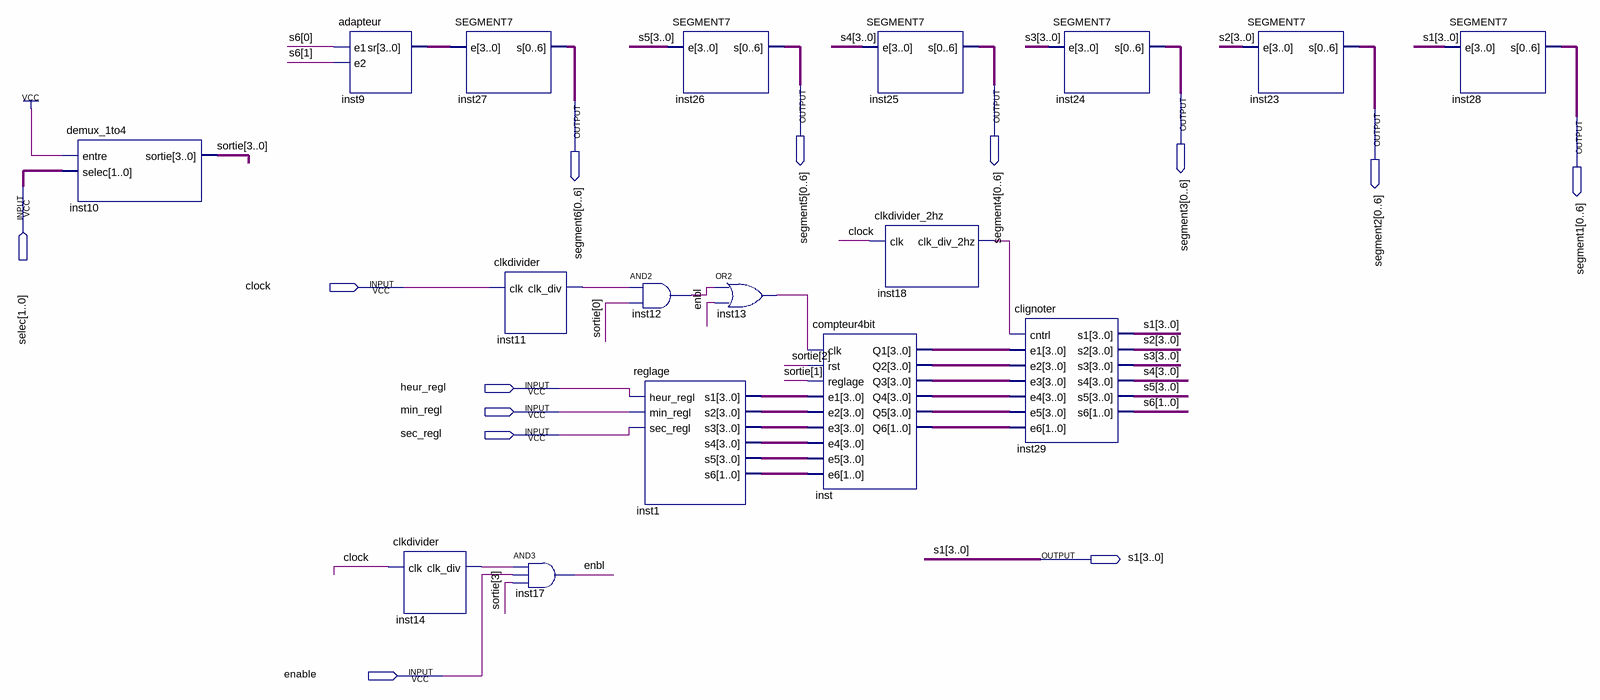
[diagram p0: schematic sheet]
// Quartus schematic disigne_principl.bdf as structural Verilog: 17 symbols, 13 pins
module disigne_principl (
  input  [1:0] selec,
  input  clock,
  input  heur_regl,
  input  min_regl,
  input  sec_regl,
  input  enable,
  output [0:6] segment5,
  output [0:6] segment4,
  output [0:6] segment3,
  output [0:6] segment6,
  output [0:6] segment2,
  output [0:6] segment1,
  output [3:0] s1
);

  wire enbl, inst11_clk_div, inst12_out, inst13_out, inst14_clk_div, inst18_clk_div_2hz;
  wire [1:0] inst1_s6, inst_q6, s6;
  wire [3:0] inst1_s1, inst1_s2, inst1_s3, inst1_s4, inst1_s5, inst9_sr, inst_q1, inst_q2, inst_q3, inst_q4,
       inst_q5, s2, s3, s4, s5, sortie;

  demux_1to4 inst10 (.entre(1'b1), .selec(selec), .sortie(sortie));
  adapteur inst9 (.e1(s6[0]), .e2(s6[1]), .sr(inst9_sr));
  clkdivider inst14 (.clk(clock), .clk_div(inst14_clk_div));
  SEGMENT7 inst27 (.e(inst9_sr), .s(segment6));
  clkdivider inst11 (.clk(clock), .clk_div(inst11_clk_div));
  and inst17 (enbl, inst14_clk_div, enable, sortie[3]);
  SEGMENT7 inst26 (.e(s5), .s(segment5));
  and inst12 (inst12_out, inst11_clk_div, sortie[0]);
  reglage inst1 (
    .heur_regl(heur_regl), .min_regl(min_regl), .sec_regl(sec_regl), .s1(inst1_s1), .s2(inst1_s2),
    .s3(inst1_s3), .s4(inst1_s4), .s5(inst1_s5), .s6(inst1_s6));
  or inst13 (inst13_out, inst12_out, enbl);
  compteur4bit inst (
    .clk(inst13_out), .rst(sortie[2]), .reglage(sortie[1]), .e1(inst1_s1), .e2(inst1_s2), .e3(inst1_s3),
    .e4(inst1_s4), .e5(inst1_s5), .e6(inst1_s6), .Q1(inst_q1), .Q2(inst_q2), .Q3(inst_q3), .Q4(inst_q4),
    .Q5(inst_q5), .Q6(inst_q6));
  SEGMENT7 inst25 (.e(s4), .s(segment4));
  clkdivider_2hz inst18 (.clk(clock), .clk_div_2hz(inst18_clk_div_2hz));
  SEGMENT7 inst24 (.e(s3), .s(segment3));
  clignoter inst29 (
    .cntrl(inst18_clk_div_2hz), .e1(inst_q1), .e2(inst_q2), .e3(inst_q3), .e4(inst_q4), .e5(inst_q5),
    .e6(inst_q6), .s1(s1), .s2(s2), .s3(s3), .s4(s4), .s5(s5), .s6(s6));
  SEGMENT7 inst23 (.e(s2), .s(segment2));
  SEGMENT7 inst28 (.e(s1), .s(segment1));
endmodule
